# EAGLE design ubertooth-zero (EAGLE 5.09)
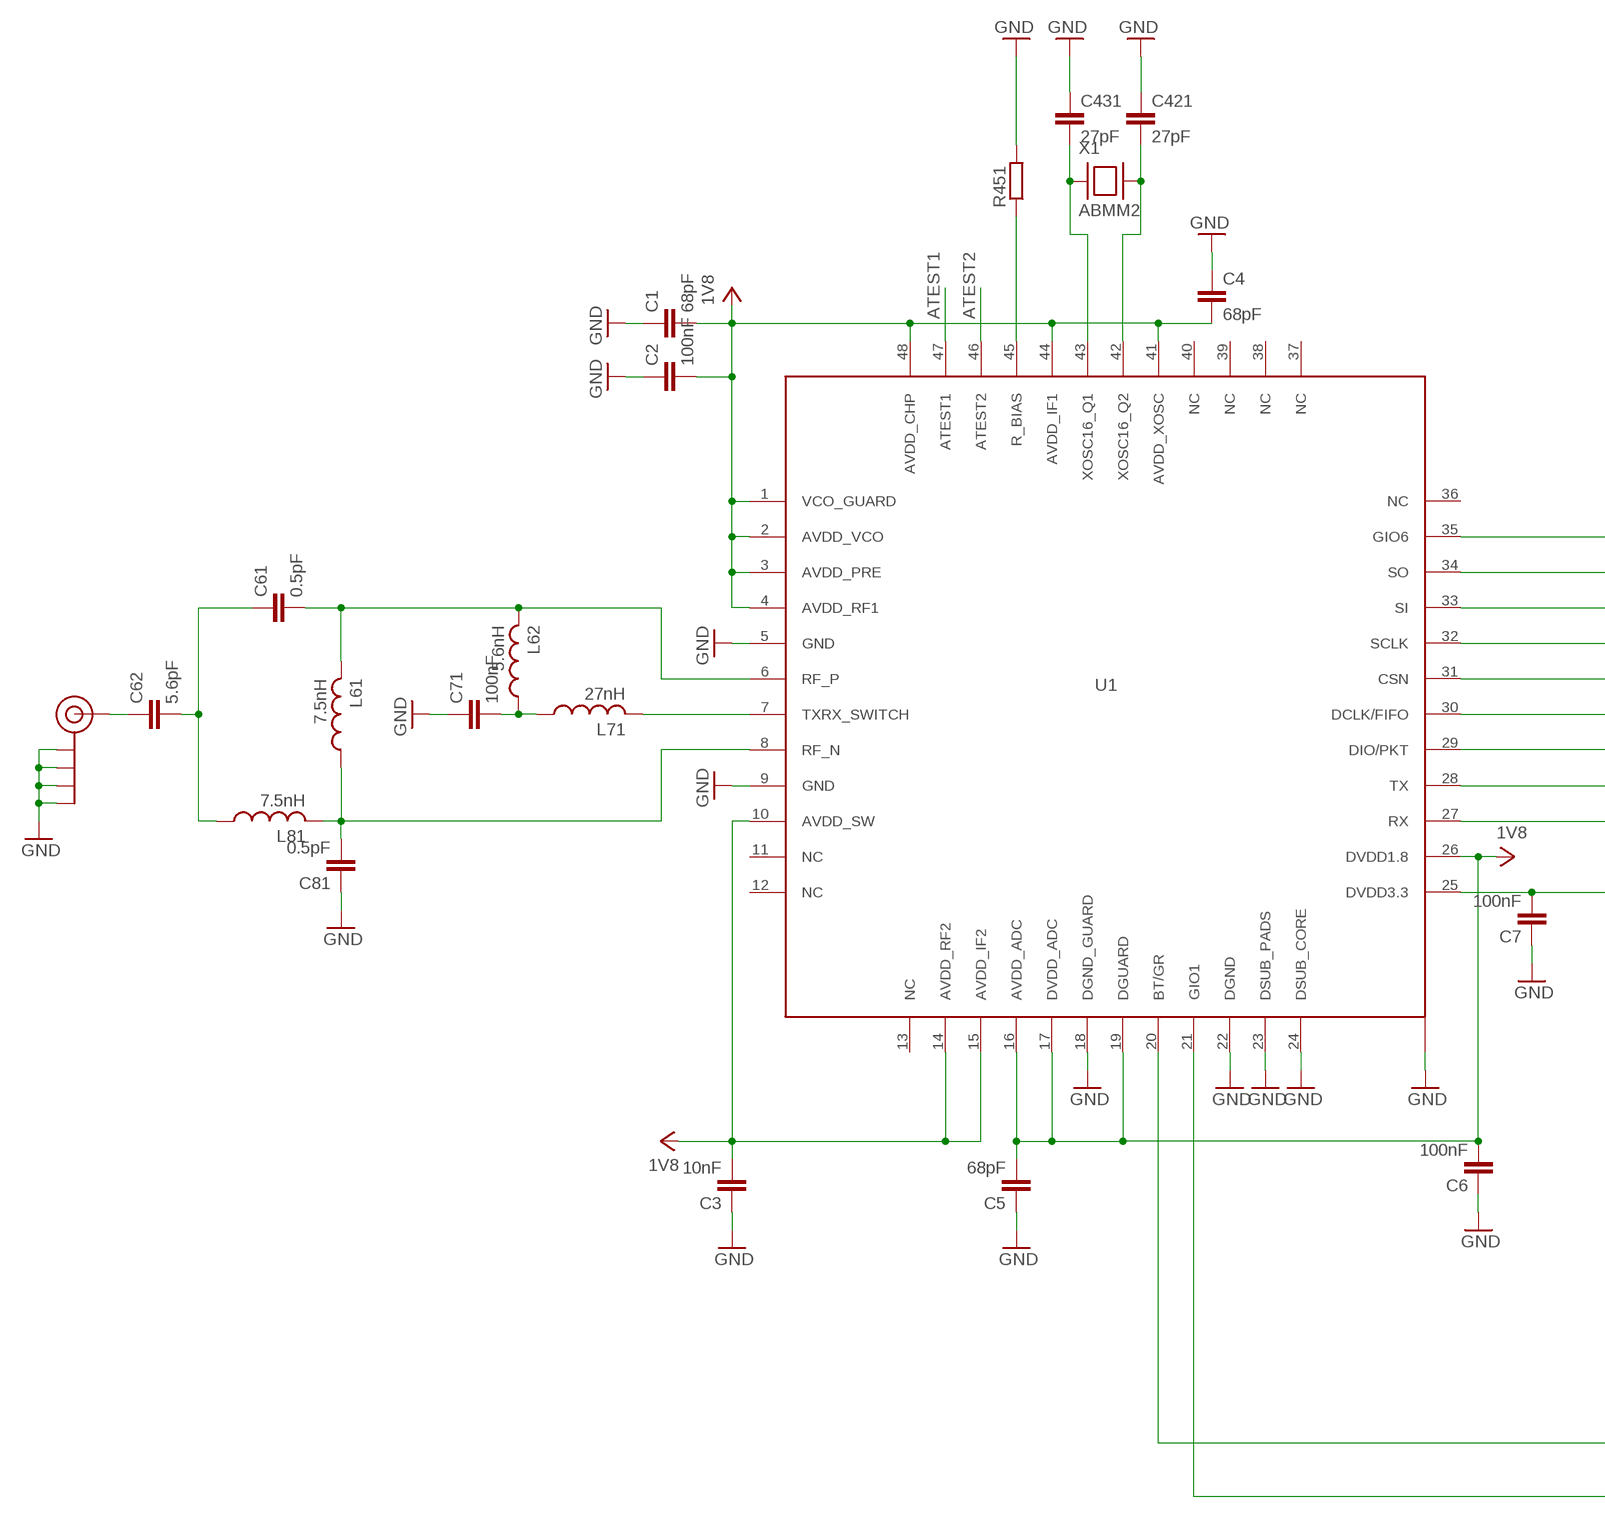
[diagram p0: schematic, sheet 1, part 1 of 2]
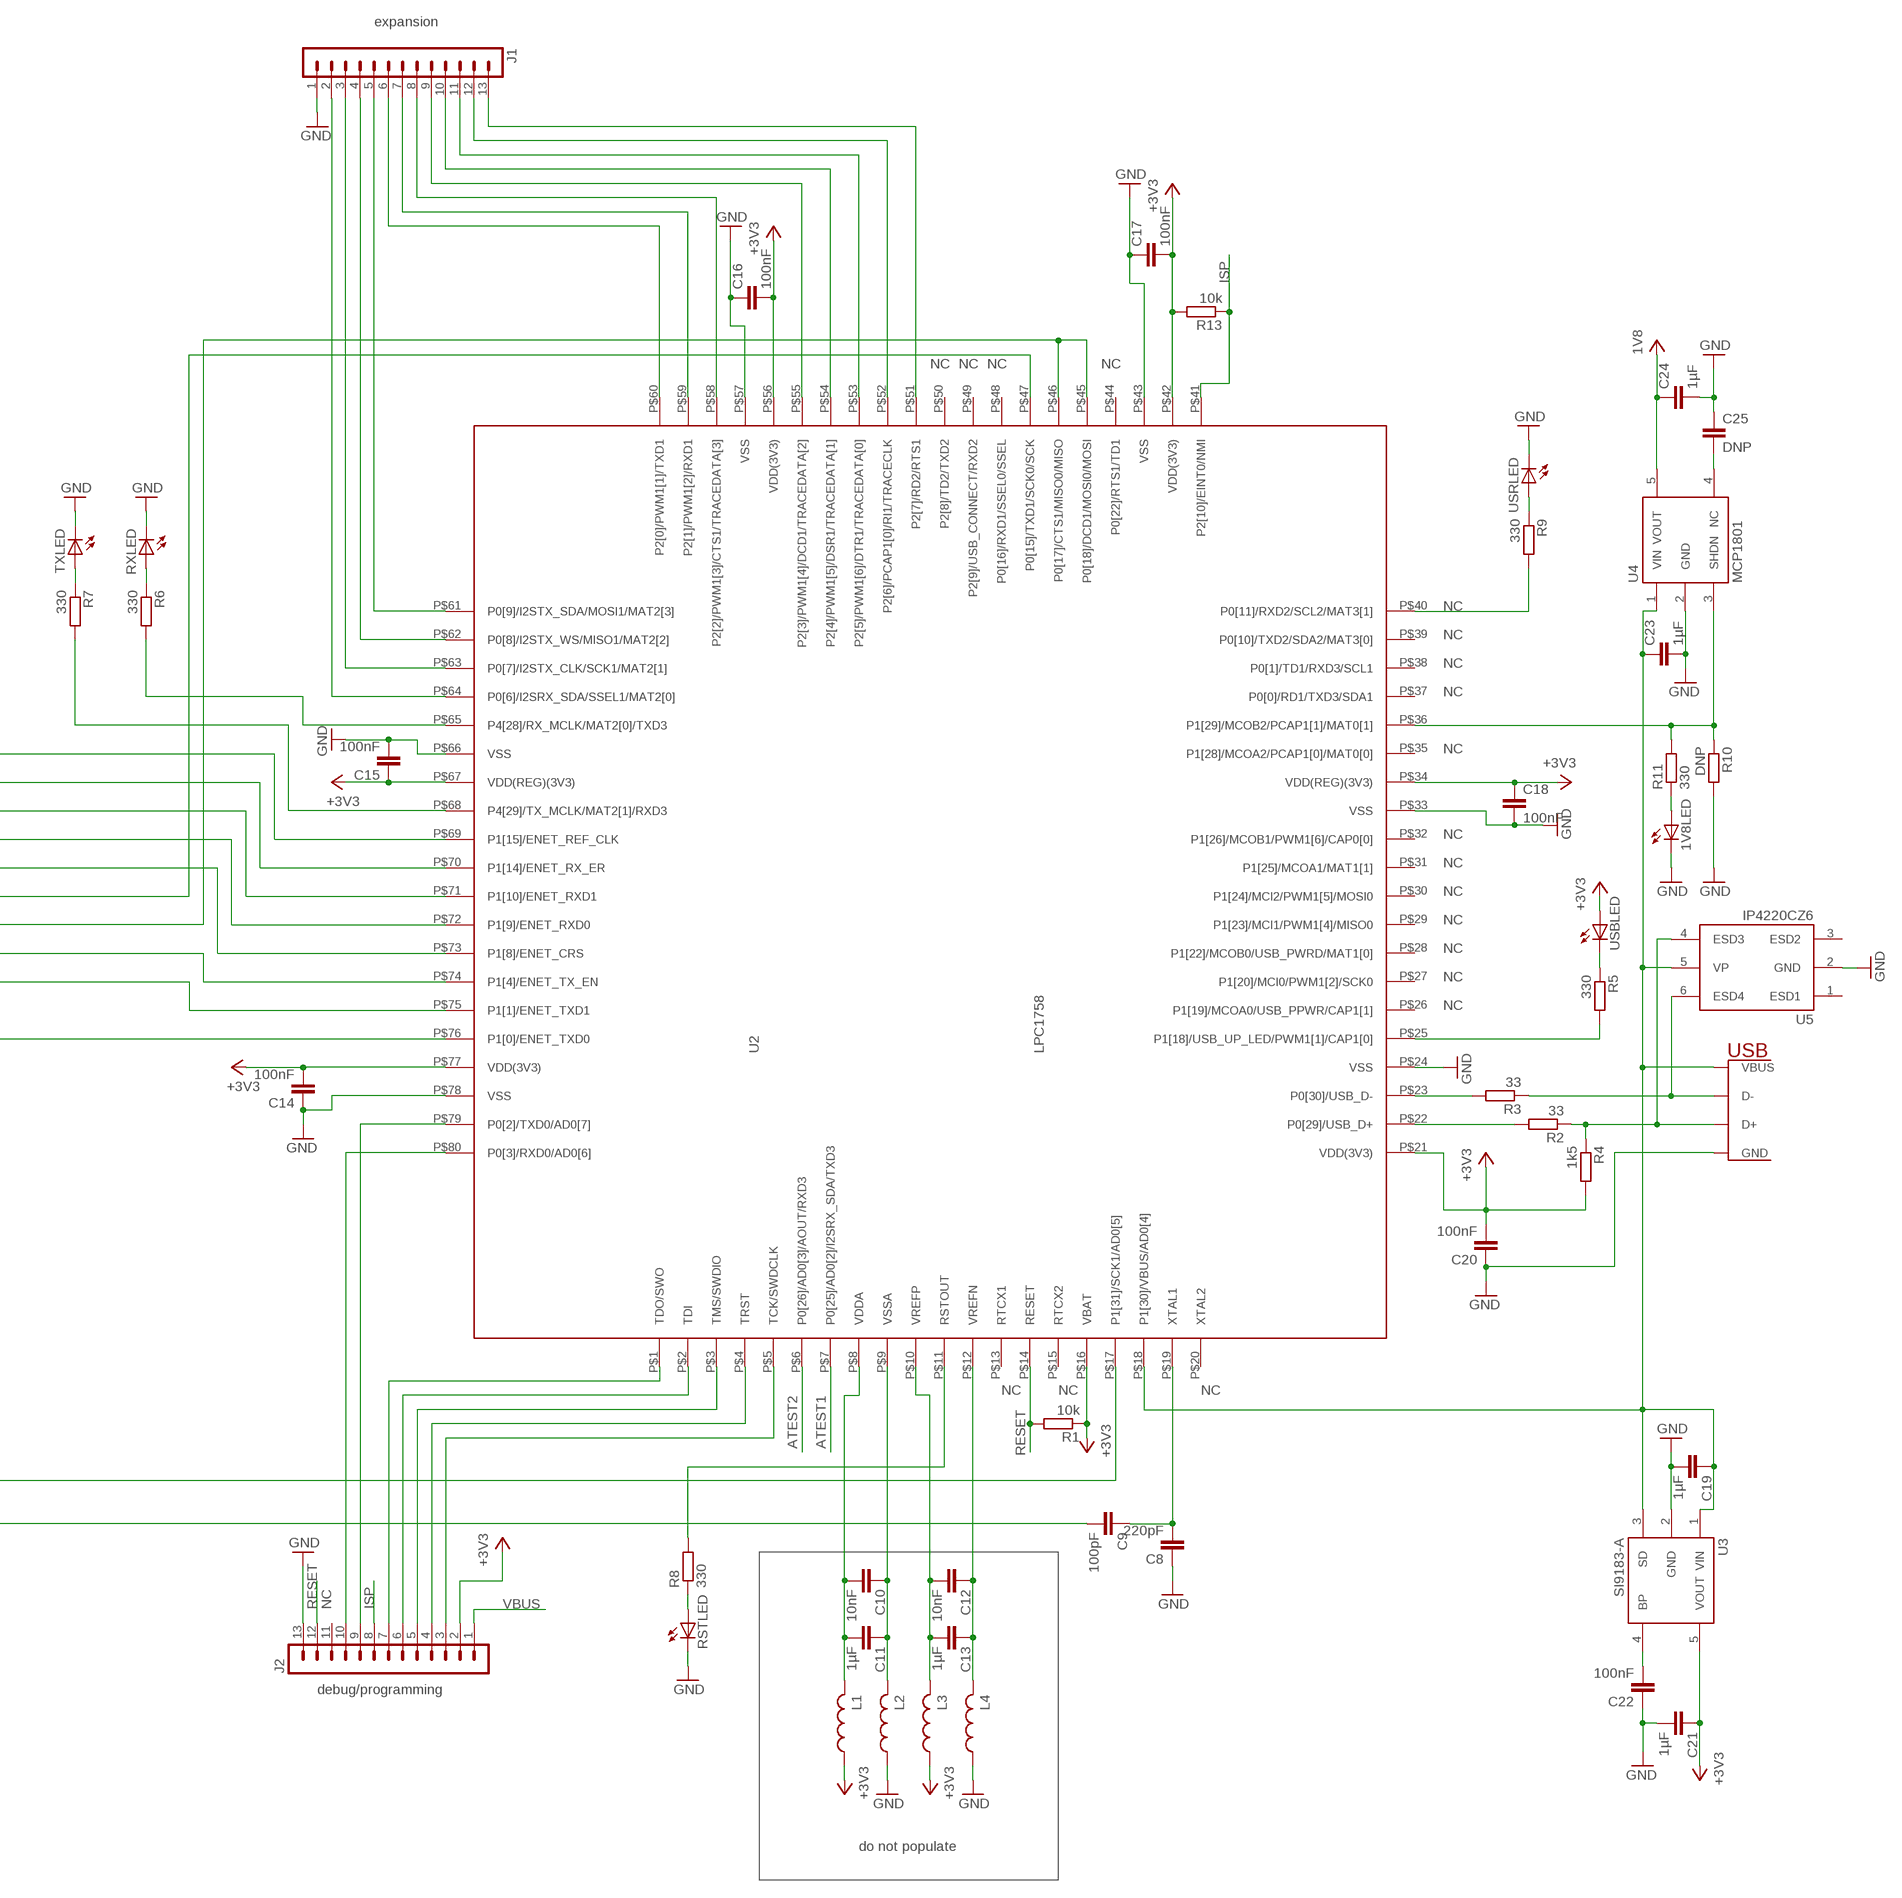
[diagram p1: schematic, sheet 1, part 2 of 2]

## Parts
1V8LED  LED0603  [LED-0603]
C1  68pF  C-EUC0402  [C0402]
C2  100nF  C-EUC0402  [C0402]
C3  10nF  C-EUC0402  [C0402]
C4  68pF  C-EUC0402  [C0402]
C5  68pF  C-EUC0402  [C0402]
C6  100nF  C-EUC0402  [C0402]
C7  100nF  C-EUC0402  [C0402]
C8  220pF  C-EUC0603  [C0603]
C9  100pF  C-EUC0603  [C0603]
C10  10nF  C-EUC0402  [C0402]
C11  1µF  C-EUC0402  [C0402]
C12  10nF  C-EUC0402  [C0402]
C13  1µF  C-EUC0402  [C0402]
C14  100nF  C-EUC0603  [C0603]
C15  100nF  C-EUC0603  [C0603]
C16  100nF  C-EUC0402  [C0402]
C17  100nF  C-EUC0603  [C0603]
C18  100nF  C-EUC0603  [C0603]
C19  1µF  C-EUC0603  [C0603]
C20  100nF  C-EUC0603  [C0603]
C21  1µF  C-EUC0603  [C0603]
C22  100nF  C-EUC0603  [C0603]
C23  1µF  C-EUC0603  [C0603]
C24  1µF  C-EUC0603  [C0603]
C25  DNP  C-EUC0603  [C0603]
C61  0.5pF  C-EUC0402  [C0402]
C62  5.6pF  C-EUC0402  [C0402]
C71  100nF  C-EUC0402  [C0402]
C81  0.5pF  C-EUC0402  [C0402]
C421  27pF  C-EUC0402  [C0402]
C431  27pF  C-EUC0402  [C0402]
J1  MA13-1  [MA13-1]
J2  MA13-1  [MA13-1]
J3  SMA_EDGE  [SMA-EDGE]
L1  L-USL0603  [L0603]
L2  L-USL0603  [L0603]
L3  L-USL0603  [L0603]
L4  L-USL0603  [L0603]
L61  7.5nH  L-USL0402  [L0402]
L62  5.6nH  L-USL0402  [L0402]
L71  27nH  L-USL0402  [L0402]
L81  7.5nH  L-USL0402  [L0402]
R1  10k  R-EU_R0603  [R0603]
R2  33  R-EU_R0603  [R0603]
R3  33  R-EU_R0603  [R0603]
R4  1k5  R-EU_R0603  [R0603]
R5  330  R-EU_R0603  [R0603]
R6  330  R-EU_R0603  [R0603]
R7  330  R-EU_R0603  [R0603]
R8  330  R-EU_R0603  [R0603]
R9  330  R-EU_R0603  [R0603]
R10  DNP  R-EU_R0603  [R0603]
R11  330  R-EU_R0603  [R0603]
R13  10k  R-EU_R0603  [R0603]
R451  R-EU_R0402  [R0402]
RSTLED  LED0603  [LED-0603]
RXLED  LED0603  [LED-0603]
TXLED  LED0603  [LED-0603]
U1  CC2400  [QFN50P700X700X100-49AN]
U2  LPC1758  LPC1758LQFP80  [LQFP80]
U3  SI9183-A  [SOT23-5]
U4  MCP1801  [SOT23-5]
U5  IP4220CZ6  [SOT457]
USBLED  LED0603  [LED-0603]
USRLED  LED0603  [LED-0603]
X1  ABMM2  [ABMM2]
X2  480371000  [480371000]

## Nets
1V8: C1.2 C2.2 C3.2 C4.2 C5.2 C6.2 C24.1 U1.1(VCO_GUARD) U1.2(AVDD_VCO) U1.3(AVDD_PRE) U1.4(AVDD_RF1) U1.10(AVDD_SW) U1.14(AVDD_RF2) U1.15(AVDD_IF2) U1.16(AVDD_ADC) U1.17(DVDD_ADC) U1.19(DGUARD) U1.26(DVDD1.8) U1.41(AVDD_XOSC) U1.44(AVDD_IF1) U1.48(AVDD_CHP) U4.5(VOUT)
1V8SHDN: R10.1 R11.2 U2.P$36(P1[29]/MCOB2/PCAP1[1]/MAT0[1]) U4.3(SHDN)
16MHZ: C9.2 U1.21(GIO1)
+3V3: C14.2 C15.1 C16.2 C17.2 C18.1 C20.2 C21.1 J2.2 L1.1 L3.1 R1.1 R4.2 R13.2 U2.P$16(VBAT) U2.P$21(VDD(3V3)) U2.P$34(VDD(REG)(3V3)) U2.P$42(VDD(3V3)) U2.P$56(VDD(3V3)) U2.P$67(VDD(REG)(3V3)) U2.P$77(VDD(3V3)) U3.5(VOUT) USBLED.A
ATEST1: U1.47(ATEST1) U2.P$7(P0[25]/AD0[2]/I2SRX_SDA/TXD3)
ATEST2: U1.46(ATEST2) U2.P$6(P0[26]/AD0[3]/AOUT/RXD3)
BT/GR: U1.20(BT/GR) U2.P$17(P1[31]/SCK1/AD0[5])
CC3V3: C7.2 U1.25(DVDD3.3) U2.P$76(P1[0]/ENET_TXD0)
CSN: U1.31(CSN) U2.P$73(P1[8]/ENET_CRS)
DCLK: U1.30(DCLK/FIFO) U2.P$47(P0[15]/TXD1/SCK0/SCK)
DIO: U1.29(DIO/PKT) U2.P$45(P0[18]/DCD1/MOSI0/MOSI) U2.P$46(P0[17]/CTS1/MISO0/MISO)
GIO6: U1.35(GIO6) U2.P$69(P1[15]/ENET_REF_CLK)
GND: 1V8LED.C C1.1 C2.1 C3.1 C4.1 C5.1 C6.1 C7.1 C8.1 C14.1 C15.2 C16.1 C17.1 C18.2 C19.2 C20.1 C21.2 C22.1 C23.2 C24.2 C25.1 C71.1 C81.1 C421.1 C431.1 J1.1 J2.13 J3.GND@0(GND) J3.GND@1(GND) J3.GND@2(GND) J3.GND@3(GND) L2.1 L4.1 R10.2 R451.2 RSTLED.C RXLED.C TXLED.C U1.5(GND) U1.9(GND) U1.18(DGND_GUARD) U1.22(DGND) U1.23(DSUB_PADS) U1.24(DSUB_CORE) U1.49(AGND) U2.P$24(VSS) U2.P$33(VSS) U2.P$43(VSS) U2.P$57(VSS) U2.P$66(VSS) U2.P$78(VSS) U3.2(GND) U4.2(GND) U5.2(GND) USRLED.C X2.P$4(GND)
ISP: J2.8 R13.1 U2.P$41(P2[10]/EINT0/NMI)
N$1: R2.1 R4.1 U5.4(ESD3) X2.P$3(D+)
N$6: R9.2 U2.P$40(P0[11]/RXD2/SCL2/MAT3[1])
N$7: R9.1 USRLED.A
N$8: J2.10 U2.P$80(P0[3]/RXD0/AD0[6])
N$9: J1.5 U2.P$61(P0[9]/I2STX_SDA/MOSI1/MAT2[3])
N$10: J1.4 U2.P$62(P0[8]/I2STX_WS/MISO1/MAT2[2])
N$11: J1.3 U2.P$63(P0[7]/I2STX_CLK/SCK1/MAT2[1])
N$12: J1.2 U2.P$64(P0[6]/I2SRX_SDA/SSEL1/MAT2[0])
N$13: J2.9 U2.P$79(P0[2]/TXD0/AD0[7])
N$14: J2.7 U2.P$1(TDO/SWO)
N$15: J2.6 U2.P$2(TDI)
N$16: J2.5 U2.P$3(TMS/SWDIO)
N$17: J2.4 U2.P$4(TRST)
N$18: J2.3 U2.P$5(TCK/SWDCLK)
N$20: C25.2 U4.4(NC)
N$24: C421.2 U1.42(XOSC16_Q2) X1.P$3
N$25: C431.2 U1.43(XOSC16_Q1) X1.P$1
N$26: R451.1 U1.45(R_BIAS)
N$27: L71.2 U1.7(TXRX_SWITCH)
N$28: C71.2 L62.1 L71.1
N$29: C61.2 L61.2 L62.2 U1.6(RF_P)
N$30: C81.2 L61.1 L81.2 U1.8(RF_N)
N$31: C61.1 C62.2 L81.1
N$32: J1.9 U2.P$55(P2[3]/PWM1[4]/DCD1/TRACEDATA[2])
N$38: R7.1 TXLED.A
N$39: C62.1 J3.SIG(SIGNAL)
N$40: R2.2 U2.P$22(P0[29]/USB_D+)
N$43: R3.2 U2.P$23(P0[30]/USB_D-)
N$44: R3.1 U5.6(ESD4) X2.P$2(D-)
N$45: R6.1 RXLED.A
N$46: R5.2 U2.P$25(P1[18]/USB_UP_LED/PWM1[1]/CAP1[0])
N$47: R5.1 USBLED.C
N$49: R7.2 U2.P$68(P4[29]/TX_MCLK/MAT2[1]/RXD3)
N$50: R6.2 U2.P$65(P4[28]/RX_MCLK/MAT2[0]/TXD3)
N$51: R8.1 RSTLED.A
N$53: J1.10 U2.P$54(P2[4]/PWM1[5]/DSR1/TRACEDATA[1])
N$54: J1.11 U2.P$53(P2[5]/PWM1[6]/DTR1/TRACEDATA[0])
N$55: J1.12 U2.P$52(P2[6]/PCAP1[0]/RI1/TRACECLK)
N$56: J1.13 U2.P$51(P2[7]/RD2/RTS1)
N$57: J1.8 U2.P$58(P2[2]/PWM1[3]/CTS1/TRACEDATA[3])
N$58: J1.7 U2.P$59(P2[1]/PWM1[2]/RXD1)
N$59: J1.6 U2.P$60(P2[0]/PWM1[1]/TXD1)
N$61: C22.2 U3.4(BP)
N$64: 1V8LED.A R11.1
RESET: J2.12 R1.2 U2.P$14(RESET)
RSTOUT: R8.2 U2.P$11(RSTOUT)
RX: U1.27(RX) U2.P$75(P1[1]/ENET_TXD1)
SCLK: U1.32(SCLK) U2.P$72(P1[9]/ENET_RXD0)
SI: U1.33(SI) U2.P$71(P1[10]/ENET_RXD1)
SO: U1.34(SO) U2.P$70(P1[14]/ENET_RX_ER)
TX: U1.28(TX) U2.P$74(P1[4]/ENET_TX_EN)
VBUS: C19.1 C23.1 J2.1 U2.P$18(P1[30]/VBUS/AD0[4]) U3.1(VIN) U3.3(SD) U4.1(VIN) U5.5(VP) X2.P$1(VBUS)
VDDA: C10.2 C11.2 L1.2 U2.P$8(VDDA)
VREFN: C12.1 C13.1 L4.2 U2.P$12(VREFN)
VREFP: C12.2 C13.2 L3.2 U2.P$10(VREFP)
VSSA: C10.1 C11.1 L2.2 U2.P$9(VSSA)
XTAL1: C8.2 C9.1 U2.P$19(XTAL1)
Unconnected: J2.11 U1.11(NC) U1.12(NC) U1.13(NC) U1.36(NC) U1.37(NC) U1.38(NC) U1.39(NC) U1.40(NC) U2.P$13(RTCX1) U2.P$15(RTCX2) U2.P$20(XTAL2) U2.P$26(P1[19]/MCOA0/USB_PPWR/CAP1[1]) U2.P$27(P1[20]/MCI0/PWM1[2]/SCK0) U2.P$28(P1[22]/MCOB0/USB_PWRD/MAT1[0]) U2.P$29(P1[23]/MCI1/PWM1[4]/MISO0) U2.P$30(P1[24]/MCI2/PWM1[5]/MOSI0) U2.P$31(P1[25]/MCOA1/MAT1[1]) U2.P$32(P1[26]/MCOB1/PWM1[6]/CAP0[0]) U2.P$35(P1[28]/MCOA2/PCAP1[0]/MAT0[0]) U2.P$37(P0[0]/RD1/TXD3/SDA1) U2.P$38(P0[1]/TD1/RXD3/SCL1) U2.P$39(P0[10]/TXD2/SDA2/MAT3[0]) U2.P$44(P0[22]/RTS1/TD1) U2.P$48(P0[16]/RXD1/SSEL0/SSEL) U2.P$49(P2[9]/USB_CONNECT/RXD2) U2.P$50(P2[8]/TD2/TXD2) U5.1(ESD1) U5.3(ESD2)

## Notes on the sheet
- expansion
- NC | NC | NC | NC
- NC
- NC
- NC
- NC
- NC
- NC
- NC
- NC
- NC
- NC
- NC
- NC
- NC | NC | NC
- NC
- debug/programming
- do not populate

## Library data of the parts
1V8LED RSTLED RXLED TXLED USBLED USRLED = SparkFun:LED: LEDs Standard schematic elements and footprints for 5mm, 3mm, 1206, and 0603 sized LEDs. 5mm - Spark Fun Electronics SKU : COM-00529 (and others)
C1-C25 C61 C62 C71 C81 C421 C431 = rcl:C-EU: CAPACITOR, European symbol
J1 J2 = mossmann:MA13-1: PIN HEADER
J3 = SparkFun:SMA_EDGE: SMA Antenna Connector End launch SMA connector. The paste layer has been removed so that the connector can be hand soldered onto the board after reflow.
L1-L4 L61 L62 L71 L81 = rcl:L-US: INDUCTOR, American symbol
R1-R11 R13 R451 = rcl:R-EU_: RESISTOR, European symbol
U1 = jared:CC2400
U2 = mossmann:LPC1758: NXP LPC1759/58/56/54/52/51 32-bit ARM Cortex-M3 CPU
U3 = mossmann:SI9183-A: Vishay Siliconix Si9183-A LDO Regulator
U4 = mossmann:MCP1801: Microchip MCP1801 150 mA, High PSRR, Low Quiescent Current LDO
U5 = mossmann:IP4220CZ6: IP4220CZ6 Dual USB 2.0 integrated ESD protection
X1 = mossmann:ABMM2: Abracon ABMM2 Ceramic Surface Mount Low Profile Crystal
X2 = mossmann:480371000: Molex 0480371000 USB Type A Male plug SMD

## Board
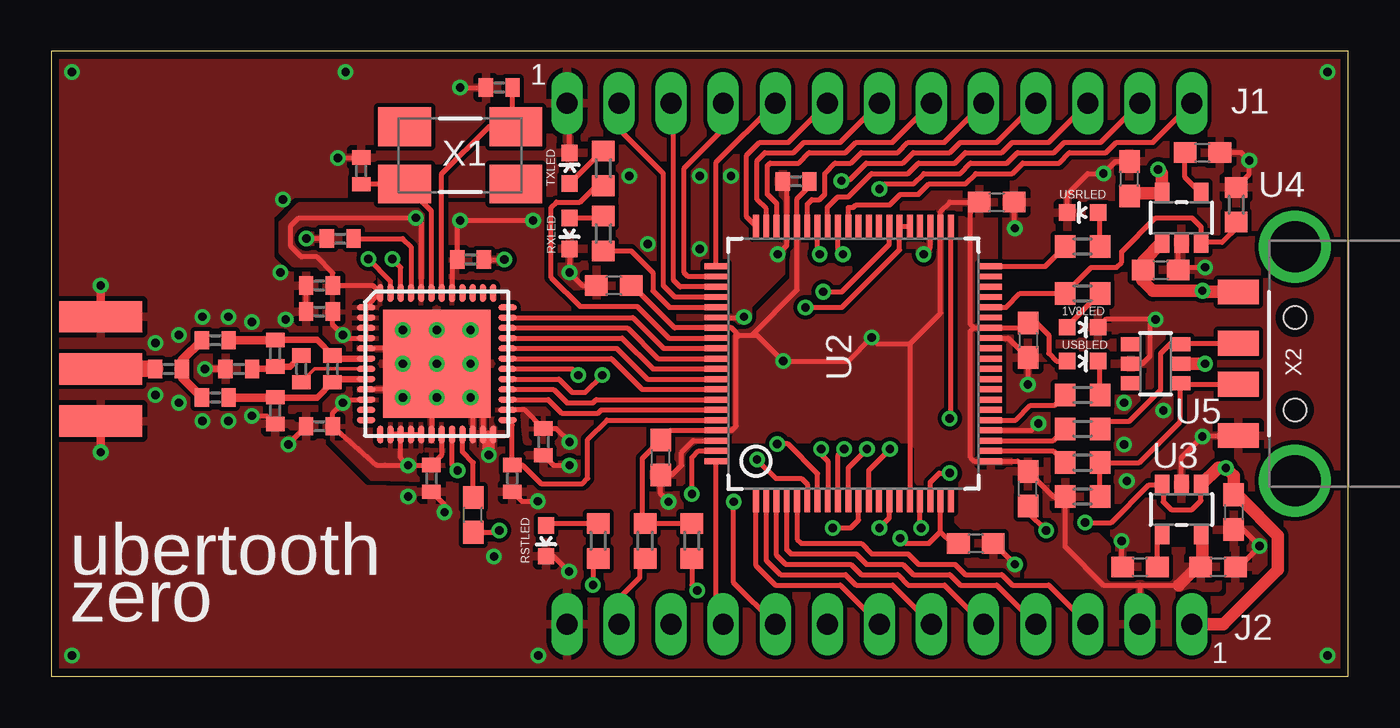
[diagram p2: board, top side]
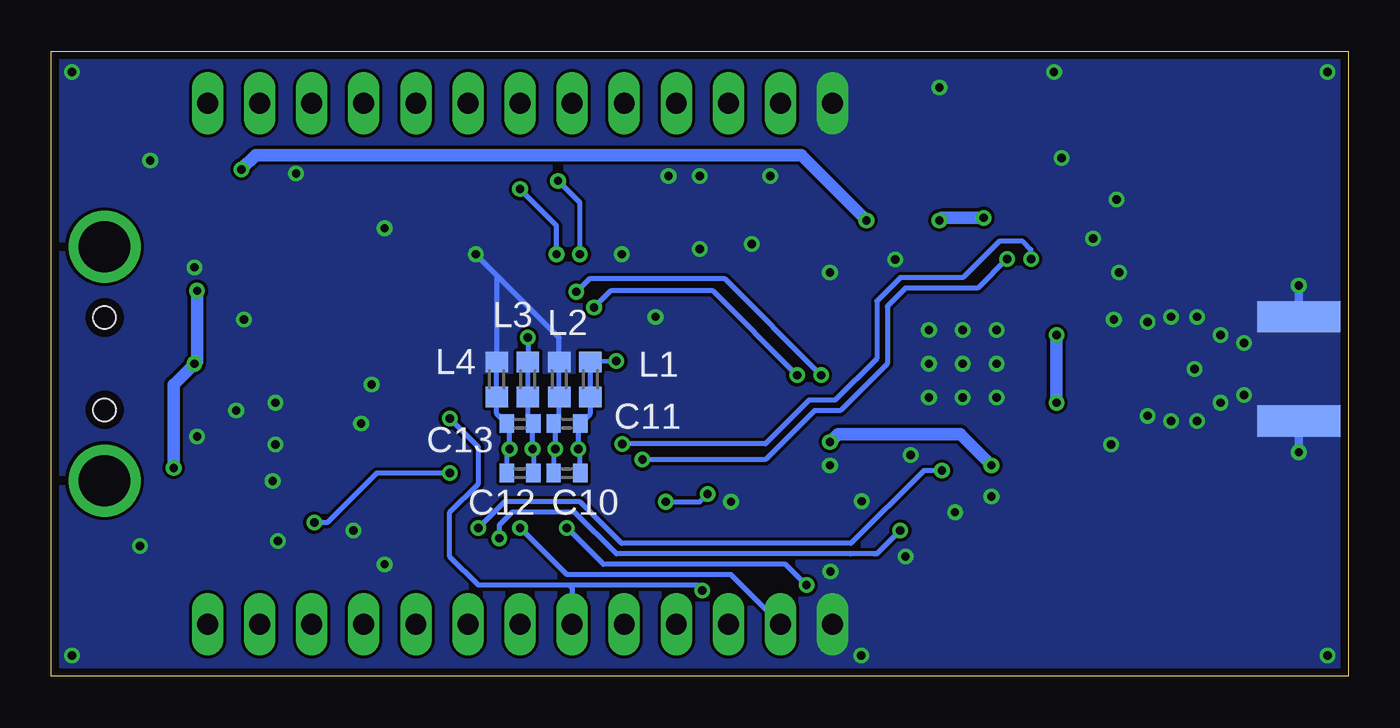
[diagram p3: board, bottom side, seen from below]

Size 63.25 x 30.47 mm. Coordinates in mm from the lower left corner, seen from the top.
Outline: 0,0 63.25,0 63.25,30.47 0,30.47 0,0
Copper layers (1*16): Top 0.0356mm / dielectric 1.5011mm / Bottom 0.0356mm
Design rules "LaenPCBOrder": minimum track width 6mil, minimum drill 13mil, track to track 6mil, track to pad 6mil, pad to pad 6mil, via to via 6mil, smd to smd 6mil, copper to edge 15mil, drill to drill 6mil, minimum pad ring 7mil, minimum via ring 7mil, stop-mask expansion 4mil, vias tented up to drill 0mil, thermal gap 10mil
bRestrict: area 36.3,14.2 to 42.2,14.7

### Footprints (pad centres in the part's own frame; a part is rotated, then mirrored left to right if it is on the bottom)
LED-0603 = smd 0.8 x 0.8: A 0,-0.75; C 0,0.75
C0402 = smd 0.7 x 0.9: 1 -0.65,0; 2 0.65,0
C0603 = smd 1.1 x 1: 1 -0.85,0; 2 0.85,0
MA13-1 = drill 1.016 long: 1 -15.24,0; 2 -12.7,0; 3 -10.16,0; 4 -7.62,0; 5 -5.08,0; 6 -2.54,0; 7 0,0; 8 2.54,0; 9 5.08,0; 10 7.62,0; 11 10.16,0; 12 12.7,0; 13 15.24,0
SMA-EDGE = smd 1.524 x 4.064: GND@0 0,0; GND@1 5.08,0; SIG 2.54,0 | smd 1.524 x 4.064 bottom: GND@2 0,0; GND@3 5.08,0
L0603 = smd 1 x 1.1: 1 -0.85,0; 2 0.85,0
L0402 = smd 0.7 x 0.9: 1 -0.65,0; 2 0.65,0
R0603 = smd 1 x 1.1: 1 -0.85,0; 2 0.85,0
R0402 = smd 0.7 x 0.9: 1 -0.65,0; 2 0.65,0
QFN50P700X700X100-49AN = smd 0.9 x 0.3: 1 -3.45,2.75; 2 -3.45,2.25; 3 -3.45,1.75; 4 -3.45,1.25; 5 -3.45,0.75; 6 -3.45,0.25; 7 -3.45,-0.25; 8 -3.45,-0.75; 9 -3.45,-1.25; 10 -3.45,-1.75; 11 -3.45,-2.25; 12 -3.45,-2.75; 25 3.45,-2.75; 26 3.45,-2.25; 27 3.45,-1.75; 28 3.45,-1.25; 29 3.45,-0.75; 30 3.45,-0.25; 31 3.45,0.25; 32 3.45,0.75; 33 3.45,1.25; 34 3.45,1.75; 35 3.45,2.25; 36 3.45,2.75 | smd 0.3 x 0.9: 13 -2.75,-3.45; 14 -2.25,-3.45; 15 -1.75,-3.45; 16 -1.25,-3.45; 17 -0.75,-3.45; 18 -0.25,-3.45; 19 0.25,-3.45; 20 0.75,-3.45; 21 1.25,-3.45; 22 1.75,-3.45; 23 2.25,-3.45; 24 2.75,-3.45; 37 2.75,3.45; 38 2.25,3.45; 39 1.75,3.45; 40 1.25,3.45; 41 0.75,3.45; 42 0.25,3.45; 43 -0.25,3.45; 44 -0.75,3.45; 45 -1.25,3.45; 46 -1.75,3.45; 47 -2.25,3.45; 48 -2.75,3.45 | smd 5.25 x 5.25: 49 0,0
LQFP80 = smd 1.1 x 0.285: P$1 -6.7,4.75; P$2 -6.7,4.25; P$3 -6.7,3.75; P$4 -6.7,3.25; P$5 -6.7,2.75; P$6 -6.7,2.25; P$7 -6.7,1.75; P$8 -6.7,1.25; P$9 -6.7,0.75; P$10 -6.7,0.25; P$11 -6.7,-0.25; P$12 -6.7,-0.75; P$13 -6.7,-1.25; P$14 -6.7,-1.75; P$15 -6.7,-2.25; P$16 -6.7,-2.75; P$17 -6.7,-3.25; P$18 -6.7,-3.75; P$19 -6.7,-4.25; P$20 -6.7,-4.75; P$41 6.7,-4.75; P$42 6.7,-4.25; P$43 6.7,-3.75; P$44 6.7,-3.25; P$45 6.7,-2.75; P$46 6.7,-2.25; P$47 6.7,-1.75; P$48 6.7,-1.25; P$49 6.7,-0.75; P$50 6.7,-0.25; P$51 6.7,0.25; P$52 6.7,0.75; P$53 6.7,1.25; P$54 6.7,1.75; P$55 6.7,2.25; P$56 6.7,2.75; P$57 6.7,3.25; P$58 6.7,3.75; P$59 6.7,4.25; P$60 6.7,4.75 | smd 0.285 x 1.1: P$21 -4.75,-6.7; P$22 -4.25,-6.7; P$23 -3.75,-6.7; P$24 -3.25,-6.7; P$25 -2.75,-6.7; P$26 -2.25,-6.7; P$27 -1.75,-6.7; P$28 -1.25,-6.7; P$29 -0.75,-6.7; P$30 -0.25,-6.7; P$31 0.25,-6.7; P$32 0.75,-6.7; P$33 1.25,-6.7; P$34 1.75,-6.7; P$35 2.25,-6.7; P$36 2.75,-6.7; P$37 3.25,-6.7; P$38 3.75,-6.7; P$39 4.25,-6.7; P$40 4.75,-6.7; P$61 4.75,6.7; P$62 4.25,6.7; P$63 3.75,6.7; P$64 3.25,6.7; P$65 2.75,6.7; P$66 2.25,6.7; P$67 1.75,6.7; P$68 1.25,6.7; P$69 0.75,6.7; P$70 0.25,6.7; P$71 -0.25,6.7; P$72 -0.75,6.7; P$73 -1.25,6.7; P$74 -1.75,6.7; P$75 -2.25,6.7; P$76 -2.75,6.7; P$77 -3.25,6.7; P$78 -3.75,6.7; P$79 -4.25,6.7; P$80 -4.75,6.7
SOT23-5 = smd 0.7 x 1: 1 0.95,1.2; 2 0,1.2; 3 -0.95,1.2; 4 -0.95,-1.2; 5 0.95,-1.2
SOT457 = smd 0.7 x 1: 1 0.95,1.2; 2 0,1.2; 3 -0.95,1.2; 4 -0.95,-1.2; 5 0,-1.2; 6 0.95,-1.2
ABMM2 = smd 2.575 x 1.9: P$1 -2.712,-1.4; P$2 2.712,-1.4; P$3 2.712,1.4; P$4 -2.712,1.4
480371000 = smd 1.2 x 2: P$1 3.5,5.35; P$2 1,5.35; P$3 -1,5.35; P$4 -3.5,5.35 | drill 2.5 round: P$5 -5.7,2.6; P$6 5.7,2.6 | hole 1.1: -2.25,2.6; 2.25,2.6

### Placement (x,y rotation side)
1V8LED  50.29,17.02 270 top
C1  13.08,19.05 0 top
C2  13.08,17.78 0 top
C3  13.08,12.19 0 top
C4  20.45,20.32 180 top
C5  18.54,9.65 90 top
C6  24,11.43 90 top
C7  22.48,9.65 90 top
C8  45.09,6.48 180 top
C9  20.57,7.87 90 top
C10  38.1,9.91 0 bottom
C11  38.1,12.32 0 bottom
C12  40.39,9.91 0 bottom
C13  40.39,12.32 0 bottom
C14  29.72,10.67 90 top
C15  27.43,19.05 180 top
C16  36.32,24.13 0 top
C17  46.1,23.11 180 top
C18  47.62,16.38 270 top
C19  57.66,8 270 top
C20  47.62,9.14 90 top
C21  56.9,5.33 0 top
C22  53.09,5.33 0 top
C23  54.1,19.81 0 top
C24  52.58,24.26 90 top
C25  56.13,25.53 180 top
C61  8,16.38 0 top
C62  5.72,14.99 0 top
C71  9.14,14.99 0 top
C81  10.92,12.95 90 top
C421  21.84,28.7 0 top
C431  15.11,24.64 270 top
J1  40.39,27.94 0 top
J2  40.39,2.54 180 top
J3  2.41,12.45 90 top
L1  36.96,14.48 270 bottom
L2  38.48,14.48 270 bottom
L3  40,14.48 270 bottom
L4  41.53,14.48 270 bottom
L61  13.72,14.99 90 top
L62  10.92,15.75 90 top
L71  12.19,14.99 270 top
L81  8,13.59 0 top
R1  28.96,6.6 270 top
R2  50.29,10.41 180 top
R3  50.29,12.06 180 top
R4  50.29,8.76 180 top
R5  50.29,13.72 180 top
R6  26.92,21.59 270 top
R7  26.92,24.77 270 top
R8  26.67,6.6 270 top
R9  50.29,20.96 180 top
R10  57.79,22.99 90 top
R11  50.29,18.67 180 top
R13  31.24,6.6 90 top
R451  14.1,21.34 180 top
RSTLED  24.13,6.6 180 top
RXLED  25.27,21.59 180 top
TXLED  25.27,24.77 0 top
U1  18.8,15.24 0 top
U2  39.12,15.24 90 top
U3  55.12,8.13 0 top
U4  55.12,22.35 180 top
U5  53.85,15.24 90 top
USBLED  50.29,15.37 270 top
USRLED  50.29,22.61 90 top
X1  19.94,25.4 0 top
X2  63.25,15.24 90 top

### Tracks (layer width: path | path; a pad name or v marks a point on that pad's centre or on a via)
1V8  (via drill 0.41)
  Top 0.254: U1.26 23.09,12.99 C6.2 24.62,12.08 v25.27,11.43 | v23.5,22.23 v19.94,22.23 19.8,22.08 C4.2 19.55,20.07 U1.41 | U1.44 18.05,22.09 v17.78,22.35 12.07,22.35 11.68,21.97 11.68,20.96 12.19,20.45 12.95,20.45 13.73,19.67 C1.2 15.69,19.05 U1.48 U1.1 U1.2 U1.3 U1.4 14.37,16.49 v14.22,16.64 13.73,17.13 C2.2 | U1.15 U1.16 U1.17 | v17.4,10.29 16.27,10.29 16.27,10.3 15.88,10.3 C3.2 13.73,12.84 v14.22,13.33 14.38,13.49 U1.10 | v17.4,10.29 17.41,10.3 C5.2 19.05,10.81 19.05,11.81 U1.19 | U1.15 U1.14 | U1.15 17.05,10.64 v17.4,10.29
  Top 0.61: v53.97,24.71 54.17,24.52 U4.5 52.72,23.55 C24.1
  Bottom 0.254: 19.81,22.35 v19.94,22.23
  Bottom 0.61: v17.4,10.29 18.92,11.81 24.89,11.81 v25.27,11.43 | v17.78,22.35 19.81,22.35 | v14.22,13.33 v14.22,16.64 | v53.97,24.71 53.29,25.4 26.67,25.4 v23.5,22.23
  pour Top (isolate 0.203): 24.13,22.99 12.07,22.99 11.18,22.1 11.18,20.7 11.81,20.07 12.95,20.07 13.34,19.69 13.34,11.94 15.62,9.65 20.19,9.53 20.07,12.45 22.99,12.45 23.11,11.43 24.51,10.79 25.91,10.79 25.91,11.56 26.92,12.32 26.92,21.08
1V8SHDN
  Top 0.254: R10.1 57.91,21.97 57.09,21.15 U4.3 56.07,21.91 55.63,22.35 53.85,22.35 52.2,20.7 52.2,20.19 51.94,19.94 50.71,19.94 R11.2 47.24,18.67 46.56,17.99 U2.P$36
16MHZ
  Top 0.254: U1.21 20.05,10.94 20.57,10.41 C9.2
+3V3  (via drill 0.41)
  Top 0.254: R13.2 R1.1 28.83,7.58 28.83,10.63 C14.2 30.19,11.99 U2.P$77 33.2,11.99 33.4,12.19 33.4,16.51 | C16.2 36.97,23.89 36.37,23.29 U2.P$56 36.37,18.84 34.16,16.64 | U3.5 56.07,6.67 56.13,6.6 | 56.13,5.45 C21.1 55.88,5.33 | 44.99,16.99 U2.P$34 47.38,16.99 C18.1 48.04,17.23 48.64,16.64 48.64,15.75 49.02,15.37 USBLED.A | 44.99,16.99 44.83,17.14 44.83,22.59 | 44.99,16.99 44.83,16.84 44.83,10.67 45.01,10.49 U2.P$21 47.13,10.49 C20.2 48.86,8.76 R4.2 | 33.4,16.51 33.4,16.76 33.17,16.99 U2.P$67 30.4,16.99 28.34,19.05 C15.1 | 34.16,16.64 33.53,16.64 33.4,16.51 | 41.87,16.21 U2.P$16 | 41.87,16.21 43.37,17.71 U2.P$42 43.37,22.67 43.81,23.11 C17.2 | 34.16,16.64 34.42,16.64 v35.69,15.37 38.86,15.37 v40,16.51 40.3,16.21 41.87,16.21 | 53.09,4.45 54.99,4.45 | 53.09,4.45 J2.2 | 49.44,8.17 49.44,7.11 49.44,6.69 49.44,6.31 51.31,4.45 53.09,4.45
  Top 0.61: 56.13,5.45 56.13,6.6 | 54.99,4.45 55.88,5.33
  Bottom 0.254: v35.69,15.37 L1.1 | v40,16.51 L3.1
  pour Top (isolate 0.203): 33.02,11.56 33.02,16.13 36.2,19.3 36.2,21.34 38.61,23.75 45.47,23.75 45.97,23.24 45.97,13.33 50.16,9.14 50.16,7.62 51.69,6.1 56.64,6.1 56.9,5.84 56.9,4.32 54.61,4.32 54.61,1.65 51.56,1.65 51.56,3.81 50.93,4.45 47.37,4.45 42.29,9.53 42.29,11.18 41.91,11.56
ATEST1  (via drill 0.41)
  Top 0.254: v15.47,20.35 16.55,19.27 U1.47 | U2.P$7 37.37,9.88 35.92,11.33 v35.41,11.33
  Bottom 0.254: v35.41,11.33 28.42,11.33 26.29,13.46 25.02,13.46 22.99,15.49 22.99,18.29 21.84,19.43 18.8,19.43 17.02,21.21 15.88,21.21 15.47,20.8 v15.47,20.35
ATEST2  (via drill 0.41)
  Top 0.254: U2.P$6 36.87,9.36 36.58,9.65 35.33,9.65 v34.42,10.57 | U1.46 17.05,19.94 v16.64,20.35
  Bottom 0.254: 16.66,20.32 v16.64,20.35 18.06,18.92 21.59,18.92 22.48,18.03 22.48,15.24 24.77,12.95 26.04,12.95 28.42,10.57 v34.42,10.57
BT/GR  (via drill 0.41)
  Top 0.254: U1.20 19.55,10.3 v19.81,10.03 | U2.P$17 42.37,7.29 v42.42,7.24
  Bottom 0.254: v19.81,10.03 20.7,10.03 24.26,6.48 35.43,6.48 37.46,8.51 41.15,8.51 v42.42,7.24
CC3V3
  Top 0.254: U1.25 22.48,12.26 C7.2 22.97,10.3 23.88,9.4 25.91,9.4 26.16,9.65 26.16,11.56 27.1,12.49 U2.P$76
CSN
  Top 0.254: U1.31 27.31,15.49 28.81,13.99 U2.P$73
DCLK  (via drill 0.41)
  Top 0.254: U2.P$47 40.87,21.05 38.56,18.75 v37.64,18.75 | U1.30 25.4,14.99 v25.71,14.68
  Bottom 0.254: v25.71,14.68 30.4,19.38 37.01,19.38 v37.64,18.75
DIO  (via drill 0.41)
  Top 0.254: U2.P$45 U2.P$46 41.37,20.79 38.56,17.98 v36.78,17.98 | U1.29 24.75,14.49 25.4,13.84 26.04,13.84 v26.87,14.68
  Bottom 0.254: v26.87,14.68 30.99,18.8 35.97,18.8 v36.78,17.98
GIO6
  Top 0.254: U2.P$69 29.86,15.99 28.36,17.49 U1.35
GND  (via drill 0.41)
  Top 0.254: TXLED.C 25.27,27.81 J1.1 | U2.P$66 33.75,17.49 v33.78,17.53 | C16.1 35.87,23.94 U2.P$57 35.87,21.01 v35.43,20.57 | X2.P$4 56.19,11.74 v56.13,11.68 55.12,10.67 U3.2 | C21.2 57.55,5.35 57.93,5.35 v58.93,6.35 58.04,7.24 57.66,7.24 C19.2 | 24.24,10.54 C6.1 24.5,10.29 v25.27,10.29 | v19.94,28.7 C421.1 | U1.18 18.55,13.34 v18.8,13.59 | U1.22 20.55,13.49 v20.45,13.59 | v20.45,13.59 21.05,12.99 U1.23 U1.24 | 16.74,13.99 U1.9 | 16.74,13.99 v17.14,13.59 v18.8,13.59 | U1.5 16.39,15.99 16.76,15.62 | 16.76,15.62 v17.14,15.24 17.14,14.39 16.74,13.99 | U2.P$24 47.8,11.99 v48.13,12.32 | C7.1 22.95,8.53 v23.72,8.53 | 1V8LED.C 51.42,17.4 v53.85,17.4 53.59,17.14 53.59,15.62 53.21,15.24 U5.2 | USRLED.C 49.54,23.51 50.55,24.51 v51.31,24.51 51.9,25.11 C24.2 | RSTLED.C 24.5,5.85 v25.25,5.1 | v18.8,13.59 U1.49 | U1.49 v20.45,15.24 | U1.49 v18.8,16.89 | v20.45,15.24 v20.45,16.89 | v17.14,16.89 17.14,16 16.76,15.62 | v20.45,15.24 v20.45,13.59 | U2.P$43 42.87,20.89 v42.54,20.57 | C5.1 19.18,8.37 v19.18,8 | C81.1 10.53,12.7 v9.78,12.7 | C8.1 45.61,6.6 45.85,6.6 v46.99,5.46 | v56.26,19.94 55.08,19.94 C23.2 54.95,20.99 U4.2 | R10.2 58.42,24.47 v58.42,25.15 58.04,25.53 C25.1 | C17.1 46.95,21.88 v46.99,21.84 | U2.P$78 31.3,11.49 30.73,10.92 30.73,10.29 30.27,9.82 C14.1 29.72,8.89 v30.1,8.51 | U2.P$33 46.67,16.49 C18.2 v47.62,14.22 | RXLED.C v25.27,19.69 25.91,19.05 C15.2 | R451.2 v12.45,21.34 | C431.1 15.1,25.27 v13.97,25.27 | C4.1 v22.1,20.32 | C2.1 C1.1 | C3.1 11.56,11.32 v11.56,11.3 | C22.1 52.2,5.33 v52.2,6.6 | C20.1 47.62,8 v48.51,7.11
  Top 0.305: C71.1 v7.49,14.99
  Top 0.406: v2.41,10.92 J3.GND@2 | v2.41,19.05 J3.GND@3
  Top 0.61: v21.34,10.79 21.34,11.68
  Bottom 0.254: L4.1 41.53,19.56 v42.54,20.57 38.48,16.51 L2.1
  Bottom 0.406: v2.41,10.92 J3.GND@2 | J3.GND@3 v2.41,19.05
  other vias: 18.8,15.24 23.75,1.02 1.02,1.02 1.02,29.46 62.23,29.46 62.23,1.02 5.08,13.72 5.08,16.26 6.22,13.33 7.37,12.45 8.64,12.45 21.59,5.84 6.22,16.64 7.37,17.53 9.78,17.27 8.64,17.53 11.43,17.4 14.35,29.46 54.23,12.95 52.32,11.3 52.32,13.33 52.45,9.53 29.08,21.08 28.19,24.38 31.62,24.38 31.62,20.83 11.18,19.69 11.3,23.24 33.15,24.38 17.4,8.76
  pour Bottom (no thermals): 0,30.48 0,0 63.25,0 63.25,30.48
  pour Top (isolate 0.203, rank 2): 0,30.48 63.25,30.48 63.25,0 0,0
ISP  (via drill 0.41)
  Top 0.254: 31.24,5.84 R13.1 31.24,4.45 v31.5,4.19 | U2.P$41 43.87,12.62 v43.81,12.57
  Bottom 0.254: v31.5,4.19 31.75,4.45 37.97,4.45 | J2.8 37.85,4.32 37.97,4.45 | v43.81,12.57 42.42,11.18 42.42,9.4 43.81,8 43.81,5.84 42.42,4.45 37.97,4.45
N$1
  Top 0.254: X2.P$3 55.1,14.24 U5.4 55.05,12.41 53.05,10.41 R2.1 R4.1
N$2
  Bottom 0.254: 37.21,15.24 36.96,14.99
N$3
  Bottom 0.254: 38.48,13.97 38.48,14.99
N$4
  Bottom 0.254: 40,13.97 40,14.99
N$5
  Bottom 0.254: 41.53,13.84 41.53,14.86
N$6
  Top 0.254: U2.P$40 48.48,19.99 R9.2
N$7
  Top 0.254: R9.1 51.14,22.51 USRLED.A
N$8
  Top 0.254: U2.P$80 32.42,2.89 J2.10
N$9
  Top 0.254: U2.P$61 32.42,25.05 J1.5
N$10
  Top 0.254: J1.4 32.77,26.67 30.86,24.77 30.86,19.69 31.06,19.49 U2.P$62
N$11
  Top 0.254: U2.P$63 30.67,18.99 30.35,19.3 30.35,27.81 J1.3
N$12
  Top 0.254: U2.P$64 30.41,18.49 29.85,19.05 29.85,24.51 27.69,26.67 J1.2
N$13  (via drill 0.41)
  Top 0.254: U2.P$79 31.56,10.99 31.24,10.67 v31.24,8.89 | v33.27,8.51 33.27,4.57 J2.9
  Bottom 0.254: v31.24,8.89 31.62,8.51 v33.27,8.51
N$14
  Top 0.254: U2.P$1 34.37,5.38 35.31,4.45 38.48,4.45 J2.7
N$15
  Top 0.254: U2.P$2 34.87,5.65 35.56,4.95 38.73,4.95 39.24,4.45 41.02,4.45 J2.6
N$16
  Top 0.254: U2.P$3 35.37,5.91 35.81,5.46 38.99,5.46 39.5,4.95 41.27,4.95 41.78,4.45 43.56,4.45 J2.5
N$17
  Top 0.254: U2.P$4 35.87,6.17 36.07,5.97 39.24,5.97 39.75,5.46 41.53,5.46 42.04,4.95 43.81,4.95 44.32,4.45 46.1,4.45 J2.4
N$18
  Top 0.254: J2.3 48.64,4.45 46.86,4.45 46.35,4.95 44.58,4.95 44.07,5.46 42.29,5.46 41.78,5.97 40,5.97 39.5,6.48 36.58,6.48 36.37,6.69 U2.P$5
N$19
  Bottom 0.254: 36.96,13.84 36.96,15.11
N$20
  Top 0.254: U4.4 55.28,24.34 C25.2
N$24
  Top 0.254: X1.P$3 21.97,26.55 | X1.P$3 22.49,26.58 C421.2 | U1.42 19.05,24.51 21.34,26.8 X1.P$3
N$25
  Top 0.254: X1.P$1 17.28,23.75 | U1.43 18.55,22.68 X1.P$1 | X1.P$1 17.21,23.99 C431.2
N$26
  Top 0.254: U1.45 17.55,20.94 17.14,21.34 R451.1
N$27
  Top 0.178: U1.7 12.85,14.99 L71.2
N$28
  Top 0.305: L71.1 11.65,15.1 L62.1 10.81,14.99 C71.2
N$29
  Top 0.305: U1.6 13.61,15.49 L61.2 12.95,16.4 L62.2
  Top 0.406: C61.2 10.91,16.38 L62.2
N$30
  Top 0.305: U1.8 13.62,14.49 L61.1 13.7,14.34 12.95,13.59 C81.2
  Top 0.406: L81.2 10.91,13.59 C81.2
N$31
  Top 0.406: C61.1 6.37,15.4 C62.2 6.37,14.58 L81.1
N$32
  Top 0.254: U2.P$55 36.87,23.02 37.08,23.24 37.46,23.24 37.72,23.5 37.72,24.51 38.23,25.02 38.99,25.02 39.5,25.53 41.27,25.53 41.78,26.04 43.56,26.04 J1.9
N$38
  Top 0.254: R7.1 26.92,25.65 26.91,25.65 TXLED.A
N$39
  Top 0.813: J3.SIG C62.1
N$40
  Top 0.254: U2.P$22 48.87,10.99 R2.2
N$43
  Top 0.254: U2.P$23 48.87,11.49 R3.2
N$44
  Top 0.254: X2.P$2 55.1,16.24 U5.6 54.54,16.19 54.1,15.75 54.1,13.97 52.58,12.45 51.52,12.45 R3.1
N$45
  Top 0.254: RXLED.A 26.82,22.34 R6.1
N$46
  Top 0.254: U2.P$25 47.03,12.49 47.75,13.21 48.93,13.21 R5.2
N$47
  Top 0.254: R5.1 51.14,15.27 USBLED.C
N$49
  Top 0.254: U2.P$68 30.12,16.49 28.57,18.03 25.78,18.03 24.38,19.43 24.38,22.86 24.64,23.11 25.78,23.11 26.42,23.75 26.76,23.75 R7.2
N$50
  Top 0.254: U2.P$65 30.14,17.99 29.34,18.8 29.34,19.69 28.28,20.74 R6.2
N$51
  Top 0.254: RSTLED.A 24.13,7.37 24.22,7.45 R8.1
N$53  (via drill 0.41)
  Top 0.254: U2.P$54 37.37,20.67 v37.46,20.57 | J1.10 46.1,26.04 44.32,26.04 43.81,25.53 42.04,25.53 41.53,25.02 39.75,25.02 38.96,24.23 38.61,24.23 v38.53,24.16
  Bottom 0.254: v37.46,20.57 37.46,23.09 v38.53,24.16
N$54
  Top 0.254: J1.11 48.64,26.04 46.86,26.04 46.35,25.53 44.58,25.53 44.07,25.02 42.29,25.02 41.78,24.51 40,24.51 38.86,23.37 38.35,23.37 37.85,22.86 37.85,21.96 U2.P$53
N$55  (via drill 0.41)
  Top 0.254: U2.P$52 38.37,21.73 38.35,21.72 38.35,20.83 v38.61,20.57 | v40.39,23.75 40.64,24 42.04,24 42.54,24.51 44.32,24.51 44.83,25.02 46.61,25.02 47.12,25.53 48.89,25.53 49.4,26.04 51.18,26.04 J1.12
  Bottom 0.254: v40.39,23.75 38.61,21.97 v38.61,20.57
N$56
  Top 0.254: U2.P$51 38.87,22.86 38.86,22.86 39.12,22.86 39.24,22.99 40.89,22.99 41.4,23.5 42.29,23.5 42.8,24 44.58,24 45.09,24.51 46.86,24.51 47.37,25.02 49.15,25.02 49.66,25.53 51.43,25.53 51.94,26.04 53.72,26.04 J1.13
N$57
  Top 0.254: J1.8 41.02,26.04 39.24,26.04 38.73,25.53 36.96,25.53 36.45,25.02 35.05,25.02 34.92,24.89 34.92,23.5 35.37,23.05 U2.P$58
N$58
  Top 0.254: J1.7 38.48,26.04 36.7,26.04 36.2,25.53 34.8,25.53 34.42,25.15 34.42,23.24 34.87,22.79 U2.P$59
N$59
  Top 0.254: J1.6 35.94,26.04 34.54,26.04 33.91,25.4 33.91,22.4 U2.P$60
N$61
  Top 0.254: C22.2 54.17,5.51 | C22.2 54.17,5.36 | U3.4 53.94,6.93 C22.2
N$64
  Top 0.254: R11.1 49.54,17.07 1V8LED.A
RESET  (via drill 0.41)
  Top 0.254: R1.2 28.87,5.84 28.7,5.84 28.7,4.83 27.69,3.81 J2.12 | U2.P$14 40.87,7.72 v40.39,7.24
  Bottom 0.254: J2.12 30.1,4.95 38.1,4.95 v40.39,7.24
RSTOUT  (via drill 0.41)
  Top 0.254: R8.2 26.42,5.5 v26.42,4.45 | U2.P$11 39.37,7.62 38.99,7.24 v38.1,7.24
  Bottom 0.254: v26.42,4.45 27.43,5.46 36.32,5.46 v38.1,7.24
RX
  Top 0.254: U1.27 24.23,13.49 24.89,12.83 26.67,12.83 26.83,12.99 U2.P$75
SCLK
  Top 0.254: U2.P$72 29.07,14.49 27.57,15.99 U1.32
SI
  Top 0.254: U2.P$71 29.33,14.99 27.83,16.49 U1.33
SO
  Top 0.254: U2.P$70 29.6,15.49 28.1,16.99 U1.34
TX
  Top 0.254: U1.28 24.49,13.99 25.15,13.33 26.42,13.33 26.57,13.49 U2.P$74
VBUS  (via drill 0.41)
  Top 0.254: C19.1 57.77,8.65 | v50.42,7.49 51.69,7.49 53.52,9.33 U3.3 54.23,9.27 54.23,8.51 54.61,8.13 55.63,8.13 56.07,8.57 U3.1 | U2.P$18 42.87,9.46 43.31,9.91 v43.81,9.91
  Top 0.61: 57.77,8.65 58.02,8.65 59.82,6.86 59.82,5.21 57.15,2.54 J2.1 | C19.1 57.66,9.78 v57.28,10.16 56.9,10.16 U3.1 | X2.P$1 56.19,18.74 v56.13,18.8 53.72,18.8 53.21,19.3 53.25,19.3 C23.1 53.25,20.24 U4.1 | v56.26,15.24 U5.5
  Bottom 0.254: v56.26,15.24 56.13,15.37 | v50.42,7.49 49.78,7.49 47.37,9.91 v43.81,9.91
  Bottom 0.61: v56.26,15.24 57.28,14.22 v57.28,10.16 | 56.13,15.37 v56.13,18.8
VDDA  (via drill 0.41)
  Top 0.254: U2.P$8 37.87,10.5 37.54,10.82 v37.54,11.07
  Bottom 0.254: C10.2 37.45,10.98 v37.54,11.07 37.54,12.23 C11.2 36.96,12.81 L1.2
VREFN  (via drill 0.41)
  Top 0.254: U2.P$12 39.87,10.05 v40.89,11.07
  Bottom 0.254: C12.1 41.04,10.93 v40.89,11.07 40.89,12.18 C13.1 41.53,12.81 L4.2
VREFP  (via drill 0.41)
  Top 0.254: U2.P$10 38.87,10.16 v39.78,11.07
  Bottom 0.254: C12.2 39.74,11.03 v39.78,11.07 39.78,12.28 C13.2 40,12.59 L3.2
VSSA  (via drill 0.41)
  Top 0.254: U2.P$9 38.37,10.78 v38.66,11.07
  Bottom 0.254: C10.1 38.75,10.98 v38.66,11.07 38.66,12.23 C11.1 38.48,12.59 L2.2
XTAL1  (via drill 0.41)
  Top 0.254: 43.37,7.04 U2.P$19 | 43.37,7.04 42.8,6.48 41.66,6.48 v41.4,6.73 | C8.2 43.93,6.48 43.37,7.04 | C9.1 21.76,7.02 v21.84,7.11
  Bottom 0.254: v41.4,6.73 41.4,7.37 40.77,8 37.72,8 35.69,5.97 24.26,5.97 23.11,5.97 22.99,5.97 v21.84,7.11

### Text on the board
tPlace: ubertooth | zero